# EAGLE schematic amyboardr3 (EAGLE 9.6.2)
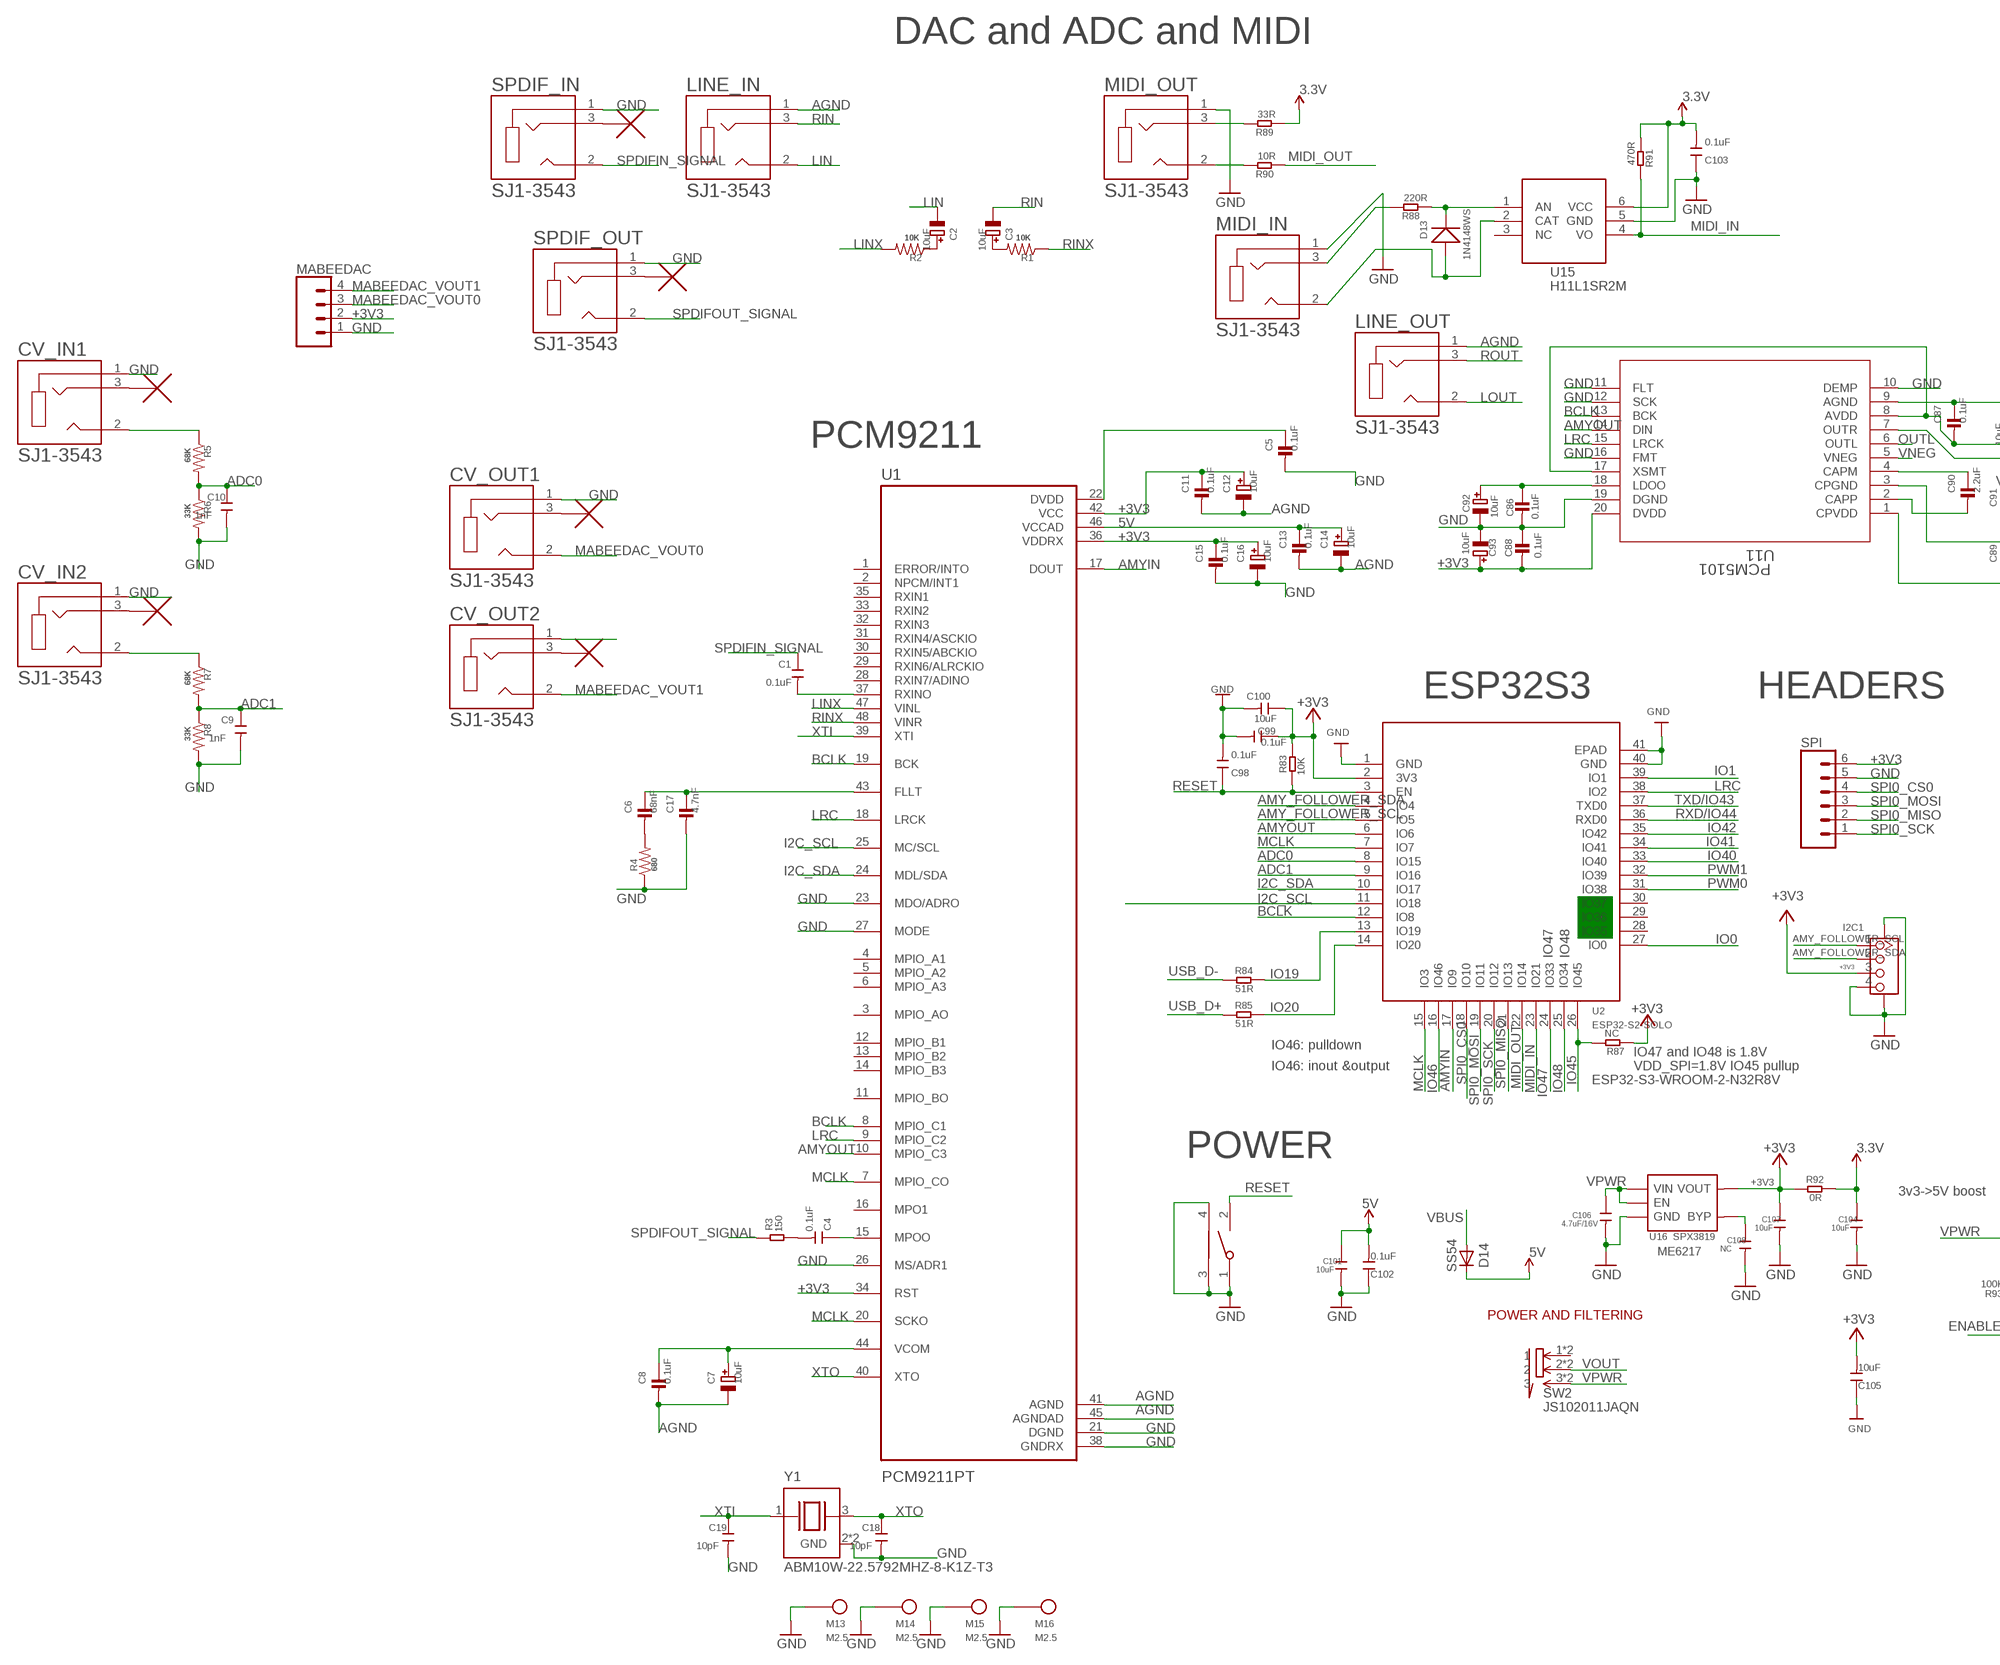
[diagram p0: schematic, sheet 1, part 1 of 2]
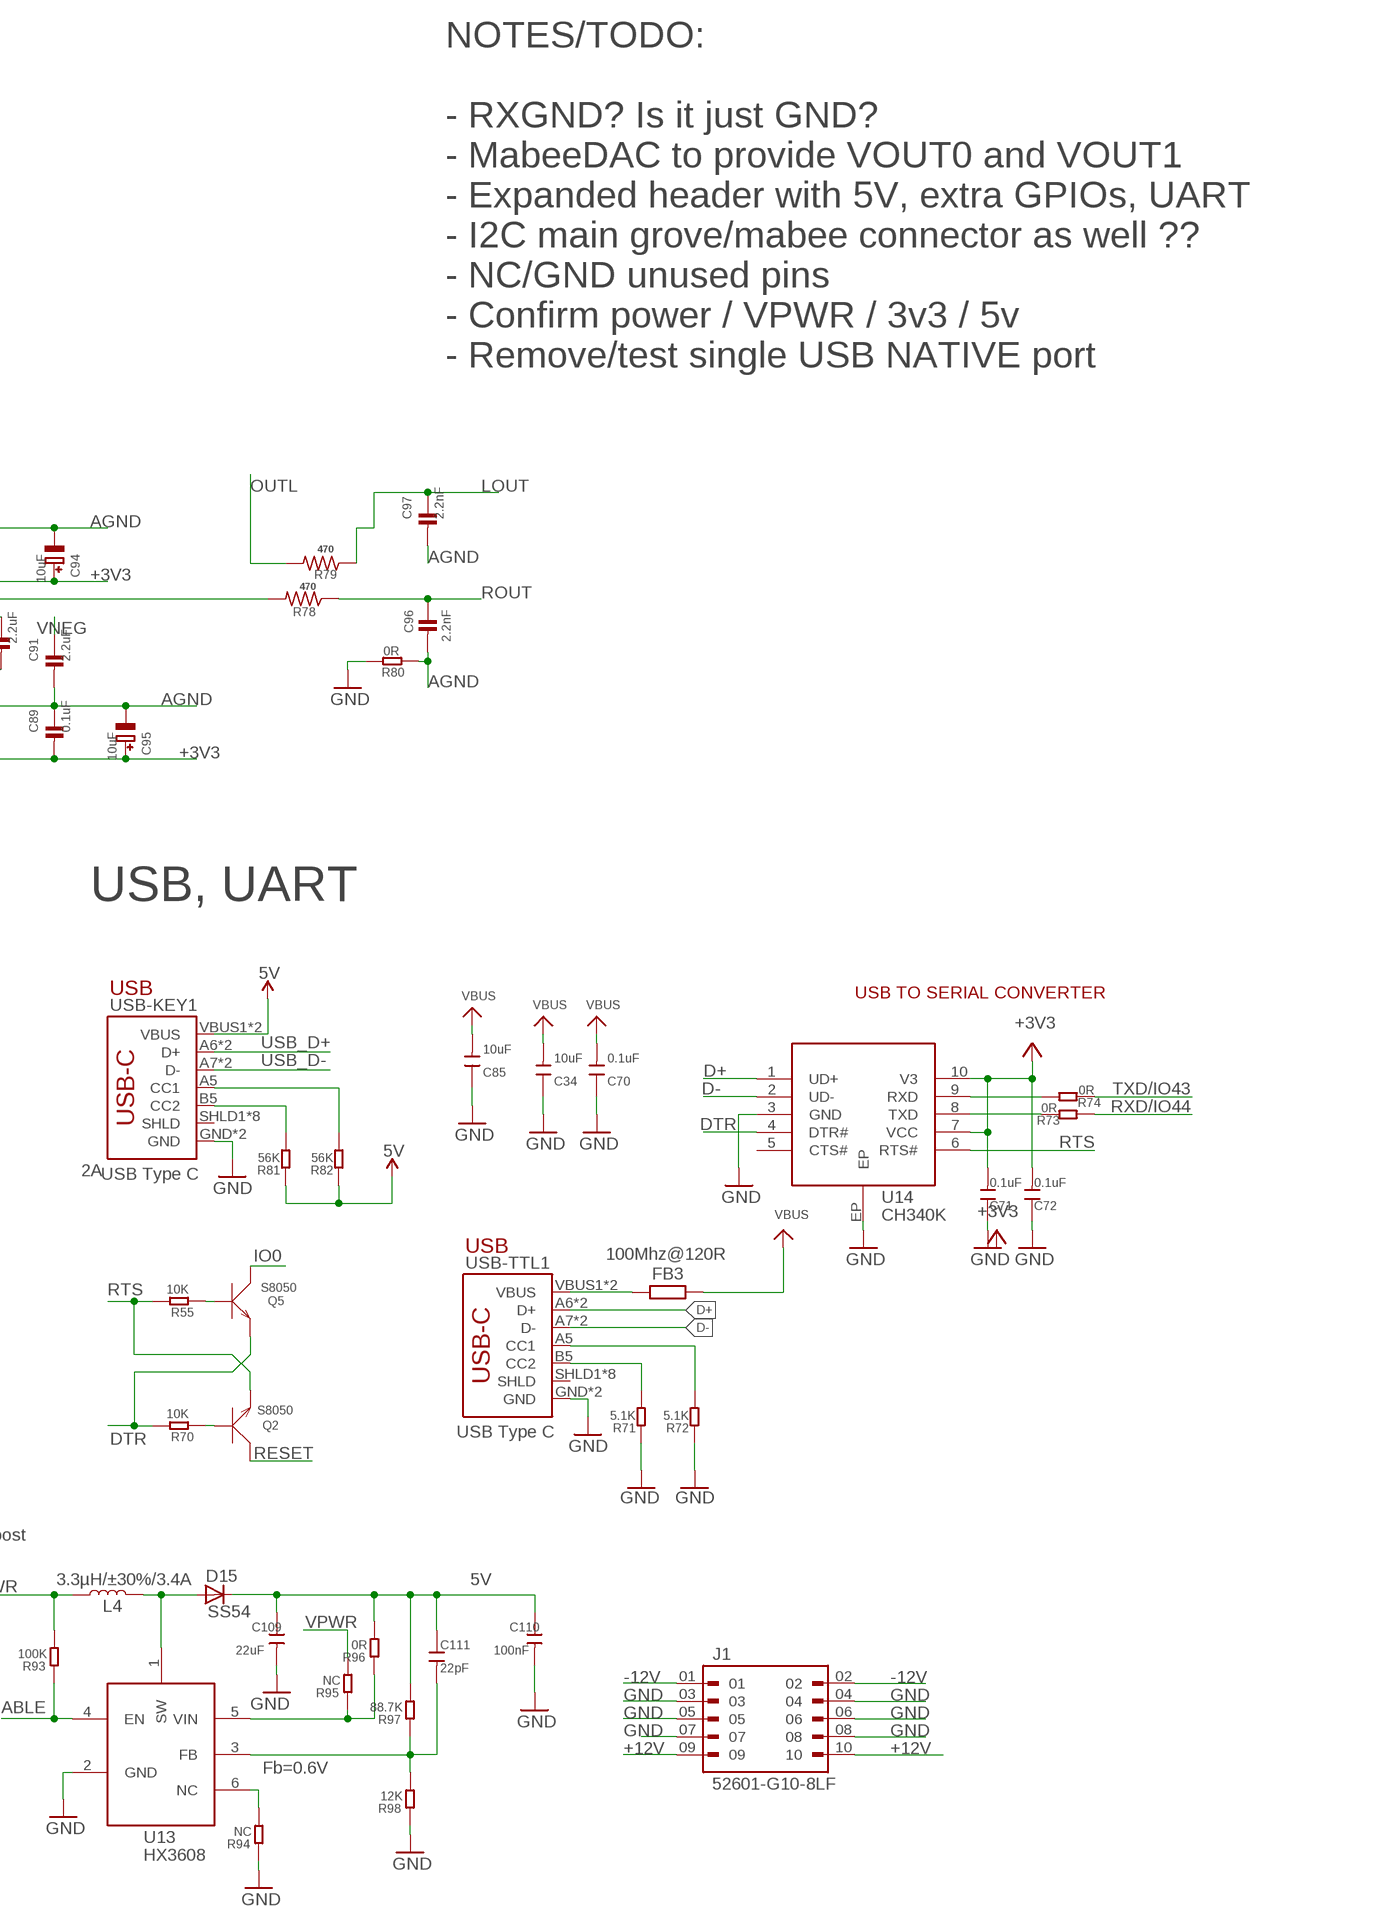
[diagram p1: schematic, sheet 1, part 2 of 2]

## Parts
C1  0.1uF  CAP-0603  [C0603]
C2  10uF  CAP_ELECTROLYTICPANASONIC_C  [PANASONIC_C]
C3  10uF  CAP_ELECTROLYTICPANASONIC_C  [PANASONIC_C]
C4  0.1uF  CAP-0603  [C0603]
C5  0.1uF  CAP_CERAMIC0805-NOOUTLINE  [0805-NO@1]
C6  68nF  CAP_CERAMIC0805-NOOUTLINE  [0805-NO@1]
C7  10uF  CAP_ELECTROLYTICPANASONIC_C  [PANASONIC_C]
C8  0.1uF  CAP_CERAMIC0805-NOOUTLINE  [0805-NO@1]
C9  1nF  CAP-0603  [C0603]
C10  1nF  CAP-0603  [C0603]
C11  0.1uF  CAP_CERAMIC0805-NOOUTLINE  [0805-NO@1]
C12  10uF  CAP_ELECTROLYTICPANASONIC_C  [PANASONIC_C]
C13  0.1uF  CAP_CERAMIC0805-NOOUTLINE  [0805-NO@1]
C14  10uF  CAP_ELECTROLYTICPANASONIC_C  [PANASONIC_C]
C15  0.1uF  CAP_CERAMIC0805-NOOUTLINE  [0805-NO@1]
C16  10uF  CAP_ELECTROLYTICPANASONIC_C  [PANASONIC_C]
C17  4.7nF  CAP_CERAMIC0805-NOOUTLINE  [0805-NO@1]
C18  10pF  CAP-0603  [C0603]
C19  10pF  CAP-0603  [C0603]
C34  10uF  DISCRETE_C-0603  [DISCRETE_C0603]
C70  0.1uF  DISCRETE_C-0603  [DISCRETE_C0603]
C71  0.1uF  DISCRETE_C-0603  [DISCRETE_C0603]
C72  0.1uF  DISCRETE_C-0603  [DISCRETE_C0603]
C85  10uF  DISCRETE_C-0603  [DISCRETE_C0603]
C86  0.1uF  CAP_CERAMIC0805-NOOUTLINE  [0805-NO@1]
C87  0.1uF  CAP_CERAMIC0805-NOOUTLINE  [0805-NO@1]
C88  0.1uF  CAP_CERAMIC0805-NOOUTLINE  [0805-NO@1]
C89  0.1uF  CAP_CERAMIC0805-NOOUTLINE  [0805-NO@1]
C90  2.2uF  CAP_CERAMIC0805-NOOUTLINE  [0805-NO@1]
C91  2.2uF  CAP_CERAMIC0805-NOOUTLINE  [0805-NO@1]
C92  10uF  CAP_ELECTROLYTICPANASONIC_C  [PANASONIC_C]
C93  10uF  CAP_ELECTROLYTICPANASONIC_C  [PANASONIC_C]
C94  10uF  CAP_ELECTROLYTICPANASONIC_C  [PANASONIC_C]
C95  10uF  CAP_ELECTROLYTICPANASONIC_C  [PANASONIC_C]
C96  2.2nF  CAP_CERAMIC0805-NOOUTLINE  [0805-NO@1]
C97  2.2nF  CAP_CERAMIC0805-NOOUTLINE  [0805-NO@1]
C98  0.1uF  DISCRETE_C-0603  [DISCRETE_C0603]
C99  0.1uF  DISCRETE_C-0603  [DISCRETE_C0603]
C100  10uF  DISCRETE_C-0603  [DISCRETE_C0603]
C101  10uF  C-0603  [0603]
C102  0.1uF  DISCRETE_C-0603  [DISCRETE_C0603]
C103  0.1uF  DISCRETE_C-0603  [DISCRETE_C0603]
C104  10uF  C-0603  [0603]
C105  10uF  DISCRETE_C-0603  [DISCRETE_C0603]
C106  4.7uF/16V  C-0603  [0603]
C107  10uF  C-0603  [0603]
C108  NC  C-0603  [0603]
C109  22uF  CAP-0603  [C0603]
C110  100nF  CAP-0603  [C0603]
C111  22pF  CAP-0603  [C0603]
CV_IN1  SJ1-3543  [CUI_SJ1-3543]
CV_IN2  SJ1-3543  [CUI_SJ1-3543]
CV_OUT1  SJ1-3543  [CUI_SJ1-3543]
CV_OUT2  SJ1-3543  [CUI_SJ1-3543]
D13  1N4148WS  D'0805'  [SOD323]
D14  SS54  DIODE-DO-214AC  [DO-214AC]
D15  SS54  DIODE-DO-214AC  [DO-214AC]
FB3  100Mhz@120R  R-EU_R0805  [R0805]
I2C1  GROVE-CONNECTOR-SMD'90D'  [HW4-SMD-2.0-90D]
J1  52601-G10-8LF  [AMPHENOL_52601-G10-8LF]
L4  3.3µH/±30%/3.4A  INDUCTOR-CR54-3.3UH  [CR54]
LINE_IN  SJ1-3543  [CUI_SJ1-3543]
LINE_OUT  SJ1-3543  [CUI_SJ1-3543]
M13  M2.5  [M2.5]
M14  M2.5  [M2.5]
M15  M2.5  [M2.5]
M16  M2.5  [M2.5]
MABEEDAC  CONN_04  [1X04]
MIDI_IN  SJ1-3543  [CUI_SJ1-3543]
MIDI_OUT  SJ1-3543  [CUI_SJ1-3543]
PCM5101  U11  PCM5101APW  [PW20_TEX]
Q2  S8050  TRANSISTOR-NPN-SOT23  [SOT23]
Q5  S8050  TRANSISTOR-NPN-SOT23  [SOT23]
R1  10K  R-US_R0805  [R0805]
R2  10K  R-US_R0805  [R0805]
R3  150  DISCRETE_R-0603  [DISCRETE_R0603]
R4  680  R-US_R0805  [R0805]
R5  68K  R-US_R0805  [R0805]
R6  33K  R-US_R0805  [R0805]
R7  68K  R-US_R0805  [R0805]
R8  33K  R-US_R0805  [R0805]
R55  10K  R-0603  [R0603]
R70  10K  R-0603  [R0603]
R71  5.1K  DISCRETE_R-0603  [DISCRETE_R0603]
R72  5.1K  DISCRETE_R-0603  [DISCRETE_R0603]
R73  0R  R-0603  [R0603]
R74  0R  R-0603  [R0603]
R78  470  R-US_R0805  [R0805]
R79  470  R-US_R0805  [R0805]
R80  0R  DISCRETE_R-0603  [DISCRETE_R0603]
R81  56K  DISCRETE_R-0603  [DISCRETE_R0603]
R82  56K  DISCRETE_R-0603  [DISCRETE_R0603]
R83  10K  R-0603  [R0603]
R84  51R  R-0603  [R0603]
R85  51R  R-0603  [R0603]
R87  NC  R-0603  [R0603]
R88  220R  R-0603  [R0603]
R89  33R  R-0603  [R0603]
R90  10R  R-0603  [R0603]
R91  470R  R-0603  [R0603]
R92  0R  R-0603  [R0603]
R93  100K  DISCRETE_R-0603  [DISCRETE_R0603]
R94  NC  DISCRETE_R-0603  [DISCRETE_R0603]
R95  NC  DISCRETE_R-0603  [DISCRETE_R0603]
R96  0R  DISCRETE_R-0603  [DISCRETE_R0603]
R97  88.7K  DISCRETE_R-0603  [DISCRETE_R0603]
R98  12K  DISCRETE_R-0603  [DISCRETE_R0603]
RST1  TS24CA  [2*4*3.5MM]
SPDIF_IN  SJ1-3543  [CUI_SJ1-3543]
SPDIF_OUT  SJ1-3543  [CUI_SJ1-3543]
SPI  CONN_06SILK_FEMALE_PTH  [1X06]
SW2  JS102011JAQN  [SMD-6-2.5MM]
U1  PCM9211PT  [QFP50P900X900X160-48N]
U2  ESP32­S2­SOLO  [ESP32-­S2-­SOLO]
U13  HX3608  [SOT-23-6]
U14  CH340K  [ESOP-10-EP-150MIL]
U15  H11L1SR2M  [SOP-6-2.54MM]
U16  SPX3819  [SOT23-5]
U$1  NC_MARKER  (no package)
U$2  NC_MARKER  (no package)
U$3  NC_MARKER  (no package)
U$4  NC_MARKER  (no package)
U$5  NC_MARKER  (no package)
U$6  NC_MARKER  (no package)
USB-KEY1  USB_C5  [USB-C-16P-5]
USB-TTL1  USB_C5  [USB-C-16P-5]
Y1  ABM10W-22.5792MHZ-8-K1Z-T3  [XTAL_ABM10W-22.5792MHZ-8-K1Z-T3]

## Nets
3.3V: C103.2 C104.1 R89.1 R91.1 R92.2 U15.6(VCC)
5V: C13.1 C14.+ C101.1 C102.2 C109.1 C110.1 C111.1 D14.C D15.C R81.1 R82.1 R96.2 R97.2 U1.46(VCCAD) USB-KEY1.VBUS1(VBUS) USB-KEY1.VBUS2(VBUS)
+3V3: C5.1 C11.1 C12.+ C15.1 C16.+ C71.2 C72.2 C87.2 C88.2 C89.2 C93.+ C94.+ C95.+ C99.1 C100.1 C105.2 C107.1 I2C1.3 MABEEDAC.2 PCM5101.1(CPVDD) PCM5101.8(AVDD) PCM5101.17(XSMT) PCM5101.20(DVDD) R83.2 R87.1 R92.1 SPI.6 U1.22(DVDD) U1.34(RST) U1.36(VDDRX) U1.42(VCC) U2.2(3V3) U14.7(VCC) U14.10(V3) U16.5(VOUT)
+12V: J1.09 J1.10
-12V: J1.01 J1.02
ADC0: C10.1 R5.2 R6.1 U2.8(IO15)
ADC1: C9.1 R7.2 R8.1 U2.9(IO16)
AGND: C7.- C8.2 C11.2 C12.- C13.2 C14.- C87.1 C89.1 C91.2 C94.- C95.- C96.2 C97.2 LINE_IN.1 LINE_OUT.1 PCM5101.3(CPGND) PCM5101.9(AGND) R80.1 U1.41(AGND) U1.45(AGNDAD)
AMY_FOLLOWER_SCL: I2C1.1 U2.5(IO5)
AMY_FOLLOWER_SDA: I2C1.2 U2.4(IO4)
AMYIN: U1.17(DOUT) U2.17(IO9)
AMYOUT: PCM5101.14(DIN) U1.10(MPIO_C3) U2.6(IO6)
BCLK: PCM5101.13(BCK) U1.8(MPIO_C1) U1.19(BCK) U2.12(IO8)
D+: U14.1(UD+) USB-TTL1.A6(D+) USB-TTL1.B6(D+)
D-: U14.2(UD-) USB-TTL1.A7(D-) USB-TTL1.B7(D-)
DTR: Q5.2(E) R70.2 U14.4(DTR#)
ENABLE: R93.1 U13.4(EN)
GND: C5.2 C9.2 C10.2 C15.2 C16.- C17.2 C18.2 C19.2 C34.1 C70.1 C71.1 C72.1 C85.1 C86.2 C88.1 C92.- C93.- C98.2 C99.2 C100.2 C101.2 C102.1 C103.1 C104.2 C105.1 C106.2 C107.2 C108.2 C109.2 C110.2 CV_IN1.1 CV_IN2.1 CV_OUT1.1 I2C1.4 I2C1.SS1 I2C1.SS2 J1.03 J1.04 J1.05 J1.06 J1.07 J1.08 M13.1 M14.1 M15.1 M16.1 MABEEDAC.1 MIDI_IN.1 MIDI_OUT.1 PCM5101.10(DEMP) PCM5101.11(FLT) PCM5101.12(SCK) PCM5101.16(FMT) PCM5101.19(DGND) R4.1 R6.2 R8.2 R71.1 R72.1 R80.2 R94.1 R98.1 RST1.1 RST1.3 RST1.4 SPDIF_IN.1 SPDIF_OUT.1 SPI.5 U1.21(DGND) U1.23(MDO/ADRO) U1.26(MS/ADR1) U1.27(MODE) U1.38(GNDRX) U2.1(GND) U2.40(GND) U2.41(EPAD) U13.2(GND) U14.3(GND) U14.EP U15.5(GND) U16.2(GND) USB-KEY1.GND USB-KEY1.GND2(GND) USB-TTL1.GND USB-TTL1.GND2(GND) Y1.2(GND) Y1.4(GND)
I2C_SCL: U1.25(MC/SCL) U2.11(IO18)
I2C_SDA: U1.24(MDL/SDA) U2.10(IO17)
IO0: Q5.3(C) U2.27(IO0)
IO1: U2.39(IO1)
IO19: R84.2 U2.13(IO19)
IO20: R85.2 U2.14(IO20)
IO40: U2.33(IO40)
IO41: U2.34(IO41)
IO42: U2.35(IO42)
IO45: R87.2 U2.26(IO45)
IO46: U2.16(IO46)
IO47: U2.24(IO33)
IO48: U2.25(IO34)
LIN: C2.- LINE_IN.2
LINX: R2.2 U1.47(VINL)
LOUT: C97.1 LINE_OUT.2 R79.1
LRC: PCM5101.15(LRCK) U1.9(MPIO_C2) U1.18(LRCK) U2.38(IO2)
MABEEDAC_VOUT0: CV_OUT1.2 MABEEDAC.3
MABEEDAC_VOUT1: CV_OUT2.2 MABEEDAC.4
MCLK: U1.7(MPIO_CO) U1.20(SCKO) U2.7(IO7) U2.15(IO3)
MIDI_IN: R91.2 U2.23(IO21) U15.4(VO)
MIDI_OUT: R90.1 U2.22(IO14)
N$1: C1.2 U1.37(RXINO)
N$2: C4.2 R3.2
N$3: C4.1 U1.15(MPOO)
N$4: C2.+ R2.1
N$5: C3.+ R1.2
N$6: C7.+ C8.1 U1.44(VCOM)
N$7: C6.1 C17.1 U1.43(FLLT)
N$8: C6.2 R4.2
N$9: SPDIF_OUT.3 U$1.P$1
N$10: SPDIF_IN.3 U$2.P$1
N$11: CV_OUT1.3 U$3.P$1
N$12: CV_OUT2.3 U$4.P$1
N$13: CV_IN1.3 U$5.P$1
N$14: CV_IN2.3 U$6.P$1
N$15: CV_OUT2.1
N$17: CV_IN1.2 R5.1
N$19: CV_IN2.2 R7.1
N$34: Q2.1(B) R70.1
N$37: Q5.1(B) R55.1
N$38: R72.2 USB-TTL1.A5(CC1)
N$39: R71.2 USB-TTL1.B5(CC2)
N$40: R74.2 U14.9(RXD)
N$41: R73.2 U14.8(TXD)
N$42: FB3.1 USB-TTL1.VBUS1(VBUS) USB-TTL1.VBUS2(VBUS)
N$48: C86.1 C92.+ PCM5101.18(LDOO)
N$50: PCM5101.7(OUTR) R78.2
N$51: C90.1 PCM5101.4(CAPM)
N$52: C90.2 PCM5101.2(CAPP)
N$53: R82.2 USB-KEY1.A5(CC1)
N$54: R81.2 USB-KEY1.B5(CC2)
N$55: D13.+ MIDI_IN.2 U15.2(CAT)
N$56: MIDI_IN.3 R88.2
N$57: D13.- R88.1 U15.1(AN)
N$58: MIDI_OUT.2 R90.2
N$59: MIDI_OUT.3 R89.2
N$60: C108.1 U16.4(BYP)
N$65: D15.A L4.P$2 U13.1(SW)
N$66: C111.2 R97.1 R98.2 U13.3(FB)
N$67: R94.2 U13.6(NC)
N$68: R95.1 R96.1 U13.5(VIN)
OUTL: PCM5101.6(OUTL) R79.2
PWM0: U2.31(IO38)
PWM1: U2.32(IO39)
RESET: C98.1 Q2.3(C) R83.1 RST1.2 U2.3(EN)
RIN: C3.- LINE_IN.3
RINX: R1.1 U1.48(VINR)
ROUT: C96.1 LINE_OUT.3 R78.1
RTS: Q2.2(E) R55.2 U14.6(RTS#)
RXD/IO44: R73.1 U2.36(RXD0)
SPDIFIN_SIGNAL: C1.1 SPDIF_IN.2
SPDIFOUT_SIGNAL: R3.1 SPDIF_OUT.2
SPI0_CS0: SPI.4 U2.18(IO10)
SPI0_MISO: SPI.2 U2.21(IO13)
SPI0_MOSI: SPI.3 U2.19(IO11)
SPI0_SCK: SPI.1 U2.20(IO12)
TXD/IO43: R74.1 U2.37(TXD0)
USB_D+: R85.1 USB-KEY1.A6(D+) USB-KEY1.B6(D+)
USB_D-: R84.1 USB-KEY1.A7(D-) USB-KEY1.B7(D-)
VBUS: C34.2 C70.2 C85.2 D14.A FB3.2
VNEG: C91.1 PCM5101.5(VNEG)
VOUT: SW2.2 SW2.2@1
VPWR: C106.1 L4.P$1 R93.2 R95.2 SW2.3 SW2.3@1 U16.1(VIN) U16.3(EN)
XTI: C19.1 U1.39(XTI) Y1.1
XTO: C18.1 U1.40(XTO) Y1.3
Unconnected: SW2.1 SW2.1@1 U1.1(ERROR/INTO) U1.2(NPCM/INT1) U1.3(MPIO_AO) U1.4(MPIO_A1) U1.5(MPIO_A2) U1.6(MPIO_A3) U1.11(MPIO_BO) U1.12(MPIO_B1) U1.13(MPIO_B2) U1.14(MPIO_B3) U1.16(MPO1) U1.28(RXIN7/ADINO) U1.29(RXIN6/ALRCKIO) U1.30(RXIN5/ABCKIO) U1.31(RXIN4/ASCKIO) U1.32(RXIN3) U1.33(RXIN2) U1.35(RXIN1) U2.28(IO35) U2.29(IO36) U2.30(IO37) U14.5(CTS#) U15.3(NC) USB-KEY1.SHLD1(SHLD) USB-KEY1.SHLD2(SHLD) USB-KEY1.SHLD3(SHLD) USB-KEY1.SHLD4(SHLD) USB-KEY1.SHLD5(SHLD) USB-KEY1.SHLD6(SHLD) USB-KEY1.SHLD7(SHLD) USB-KEY1.SHLD8(SHLD) USB-TTL1.SHLD1(SHLD) USB-TTL1.SHLD2(SHLD) USB-TTL1.SHLD3(SHLD) USB-TTL1.SHLD4(SHLD) USB-TTL1.SHLD5(SHLD) USB-TTL1.SHLD6(SHLD) USB-TTL1.SHLD7(SHLD) USB-TTL1.SHLD8(SHLD)

## Notes on the sheet
- DAC and ADC and MIDI
- NOTES/TODO:
  
  - RXGND? Is it just GND? 
  - MabeeDAC to provide VOUT0 and VOUT1
  - Expanded header with 5V, extra GPIOs, UART
  - I2C main grove/mabee connector as well ??
  - NC/GND unused pins
  - Confirm power / VPWR / 3v3 / 5v
  - Remove/test single USB NATIVE port
- PCM9211
- ESP32S3 | HEADERS | USB, UART
- USB | USB TO SERIAL CONVERTER
- 2A | USB Type C
- IO47 | IO48
- USB
- IO46: pulldown
- IO47 and IO48 is 1.8V
- IO46: inout &output | VDD_SPI=1.8V IO45 pullup
- ESP32-S3-WROOM-2-N32R8V
- USB Type C
- POWER
- 3v3->5V boost
- ME6217
- POWER AND FILTERING
- Fb=0.6V

## Library data of the parts
C1 C4 C9 C10 C18 C19 C109-C111 = Discrete-new:CAP: Ceramic Capacitors
C2 C3 C7 C12 C14 C16 C92-C95 = microbuilder:CAP_ELECTROLYTIC: Electrolytic Capacitors SMT PANASONIC_C - Size C Panasonic Electrolytic Aluminum Capacitor 47µF 16V 20% Electrolytic Capacitor [Digikey: PCE3890TR-ND] PANASONIC_D - Size D Panasonic Electrolytic Aluminum Capacitor 100µF 25V 20% Electrolytic Capacitor [Digikey: PCE3898TR-ND] PTH 3.5 mm grid, 8 mm diameter ... 3.5 mm grid, 10 mm diameter ...
C5 C6 C8 C11 C13 C15 C17 C86-C91 C96 C97 = microbuilder:CAP_CERAMIC: Ceramic Capacitors For new designs, use the packages preceded by an '_' character since they are more reliable: The following footprints should be used on most boards: _0402 - Standard footprint for regular board layouts _0603 - Standard footprint for regular board layouts _0805 - Standard footprint for regular board layouts _1206 - Standard footprint for regular board layouts For extremely tight-pitch boards where space is at a premium, the following 'micro-pitch' footprints can be used (smaller pads, no silkscreen outline, etc.): _0402MP - Micro-pitch footprint for very dense/compact boards _0603MP - Micro-pitch footprint for very dense/compact boards _0805MP - Micro-pitch footprint for very dense/compact boards _1206MP - Micro-pitch footprint for very dense/compact boards
C34 C70-C72 C85 C98-C100 C102 C103 C105 = A9G:DISCRETE_C*: Ceramic Capacitors
C101 C104 C106-C108 = Discrete:C*: Ceramic Capacitors
CV_IN1 CV_IN2 CV_OUT1 CV_OUT2 LINE_IN LINE_OUT MIDI_IN MIDI_OUT SPDIF_IN SPDIF_OUT = SJ1-3543:SJ1-3543: Check availability <https://pricing.snapeda.com/parts/SJ1-3543/Same%20Sky/view-part?ref=eda>; AVAILABILITY: In Stock; CHECK_PRICES: https://www.snapeda.com/parts/SJ1-3543/Same+Sky/view-part/?ref=eda; DESCRIPTION: 3.5 mm Right-Angle Stereo Jack, 3 Pin PCB Mount, Threaded w/ Nut; MF: Same Sky; MP: SJ1-3543; PACKAGE: None; PRICE: None; SNAPEDA_LINK: https://www.snapeda.com/parts/SJ1-3543/Same+Sky/view-part/?ref=snap
D13 = Discrete:D*
D14 D15 = diode:DIODE-: DIODE
FB3 = rcl:R-EU_: RESISTOR, European symbol
I2C1 = Connector-new:GROVE-CONNECTOR-SMD: 4P-SMD-2.0:320110030;4P-SMD-2.0-90D:320110032
J1 = 52601-G10-8LF:52601-G10-8LF: Check availability <https://pricing.snapeda.com/parts/52601-G10-8LF/Amphenol%20ICC/view-part?ref=eda>; AVAILABILITY: In Stock; CHECK_PRICES: https://www.snapeda.com/parts/52601-G10-8LF/Amphenol+FCI/view-part/?ref=eda; DESCRIPTION: Conn; Rect; Header; SMT; Shroud; 2.54 mm; 2-Row; 10 Pos; Gold (30) Plate;Quickie | Amphenol FCI (Amphenol CS) 52601-G10-8LF; MF: Amphenol ICC; MP: 52601-G10-8LF; PACKAGE: None; PRICE: None; SNAPEDA_LINK: https://www.snapeda.com/parts/52601-G10-8LF/Amphenol+FCI/view-part/?ref=snap
L4 = SparkFun-Coils:INDUCTOR: Inductors Resist changes in electrical current. Basically a coil of wire. SparkFun Products: SparkFun Load Cell Amplifier - HX711 <https://www.sparkfun.com/products/13879> IOIO-OTG - V2.2 <https://www.sparkfun.com/products/13613>; PROD_ID: NDUC-11157
M13-M16 = sale:M2.5
MABEEDAC = SparkFun-Connectors:CONN_04: Multi connection point. Often used as Generic Header-pin footprint for 0.1 inch spaced/style header connections On any of the 0.1 inch spaced packages, you can populate with these: Break Away Headers - Straight <https://www.sparkfun.com/products/116> (PRT-00116) Break Away Male Headers - Right Angle <https://www.sparkfun.com/products/553> (PRT-00553) Female Headers <https://www.sparkfun.com/products/115> (PRT-00115) Break Away Headers - Machine Pin <https://www.sparkfun.com/products/117> (PRT-00117) Break Away Female Headers - Swiss Machine Pin <https://www.sparkfun.com/products/743> (PRT-00743) For SCREWTERMINALS and SPRING TERMINALS visit here: Screw Terimnals on SparkFun.com <https://www.sparkfun.com/search/results?term=Screw+Terminals> (5mm/3.5mm/2.54mm spacing) This device is also useful as a general connection point to wire up your design to another part of your project. Our various solder wires solder well into these plated through hole pads. Hook-Up Wire - Assortment (Stranded, 22 AWG) <https://www.sparkfun.com/products/11375> (PRT-11375) Hook-Up Wire - Assortment (Solid Core, 22 AWG) <https://www.sparkfun.com/products/11367> (PRT-11367) View the entire wire category on our website here <https://www.sparkfun.com/categories/141> Special notes: Molex polarized connector foot print use with SKU : PRT-08231 with associated crimp pins and housings. 1MM SMD Version SKU: PRT-10208; PROD_ID: CONN-09696
PCM5101 = pcm5101apw:PCM5101APW; COPYRIGHT: Copyright (C) 2022 Ultra Librarian. All rights reserved.; DIGI-KEY_PART_NUMBER_1: PCM5101APW-ND; MANUFACTURER_PART_NUMBER: PCM5101APW; MFR_NAME: Texas Instruments
Q2 Q5 = Discrete:TRANSISTOR-NPN*: NPN audion
R1 R2 R4-R8 R78 R79 = adafruit:R-US_: RESISTOR, American symbol
R3 R71 R72 R80-R82 R93-R98 = A9G:DISCRETE_R*
R55 R70 R73 R74 R83-R85 R87-R92 = Discrete:R*
RST1 = sale:TS24CA
SPI = SparkFun-Connectors:CONN_06: Multi connection point. Often used as Generic Header-pin footprint for 0.1 inch spaced/style header connections On any of the 0.1 inch spaced packages, you can populate with these: Break Away Headers - Straight <https://www.sparkfun.com/products/116> (PRT-00116) Break Away Male Headers - Right Angle <https://www.sparkfun.com/products/553> (PRT-00553) Female Headers <https://www.sparkfun.com/products/115> (PRT-00115) Break Away Headers - Machine Pin <https://www.sparkfun.com/products/117> (PRT-00117) Break Away Female Headers - Swiss Machine Pin <https://www.sparkfun.com/products/743> (PRT-00743) Arduino Stackable Header - 6 Pin <https://www.sparkfun.com/products/9280> (PRT-09280) For SCREWTERMINALS and SPRING TERMINALS visit here: Screw Terimnals on SparkFun.com <https://www.sparkfun.com/search/results?term=Screw+Terminals> (5mm/3.5mm/2.54mm spacing) This device is also useful as a general connection point to wire up your design to another part of your project. Our various solder wires solder well into these plated through hole pads. Hook-Up Wire - Assortment (Stranded, 22 AWG) <https://www.sparkfun.com/products/11375> (PRT-11375) Hook-Up Wire - Assortment (Solid Core, 22 AWG) <https://www.sparkfun.com/products/11367> (PRT-11367) View the entire wire category on our website here <https://www.sparkfun.com/categories/141>; PROD_ID: CONN-08437
SW2 = sale:JS102011JAQN
U1 = PCM9211PT:PCM9211PT: Check availability <https://pricing.snapeda.com/parts/PCM9211PT/Texas%20Instruments/view-part?ref=eda>; AVAILABILITY: In Stock; CHECK_PRICES: https://www.snapeda.com/parts/PCM9211PT/Texas+Instruments/view-part/?ref=eda; DESCRIPTION: 216kHz Digital Audio Interface Transceiver (DIX) with Stereo ADC and Routing; MF: Texas Instruments; MP: PCM9211PT; PACKAGE: LQFP-48 Texas Instruments; PRICE: None; SNAPEDA_LINK: https://www.snapeda.com/parts/PCM9211PT/Texas+Instruments/view-part/?ref=snap
U2 = self:ESP32­S2­SOLO
U13 = self:HX3608
U14 = sale:CH340K
U15 = sale:H11L1SR2M
U16 = IC:SPX3819
U$1-U$6 = NC_MARKER:NC_MARKER
USB-KEY1 USB-TTL1 = USBC:USB_C: USB Type C 16Pin Connector Super Speed pins not available on the 16-pin purely SMD connector so this part is best for USB 2.0 implementations. D1 and D2 are tied together enabling D+/- no matter which way the cable is plugged into the connector. The two channel configuration pins (CC1/2) are exposed. These are normally connected to ground via 5.1k resistors but can be reconfigured for high current/high power applications.
Y1 = ABM10W-22.5792MHZ-8-K1Z-T3:ABM10W-22.5792MHZ-8-K1Z-T3: Check availability <https://pricing.snapeda.com/parts/ABM10W-22.5792MHZ-8-K1Z-T3/Abracon/view-part?ref=eda>; AVAILABILITY: In Stock; CHECK_PRICES: https://www.snapeda.com/parts/ABM10W-22.5792MHZ-8-K1Z-T3/Abracon/view-part/?ref=eda; DESCRIPTION: IoT OPTIMIZED LOW PROFILE QUARTZ CRYSTAL; MF: Abracon; MP: ABM10W-22.5792MHZ-8-K1Z-T3; PACKAGE: SMD-4 Abracon; PRICE: None; SNAPEDA_LINK: https://www.snapeda.com/parts/ABM10W-22.5792MHZ-8-K1Z-T3/Abracon/view-part/?ref=snap

## Net classes
0 default: width 0.203 mm, drill 0.305 mm, clearance 0.152 mm